# Altium schematic sheet AFE1-2.SchDoc
size A4
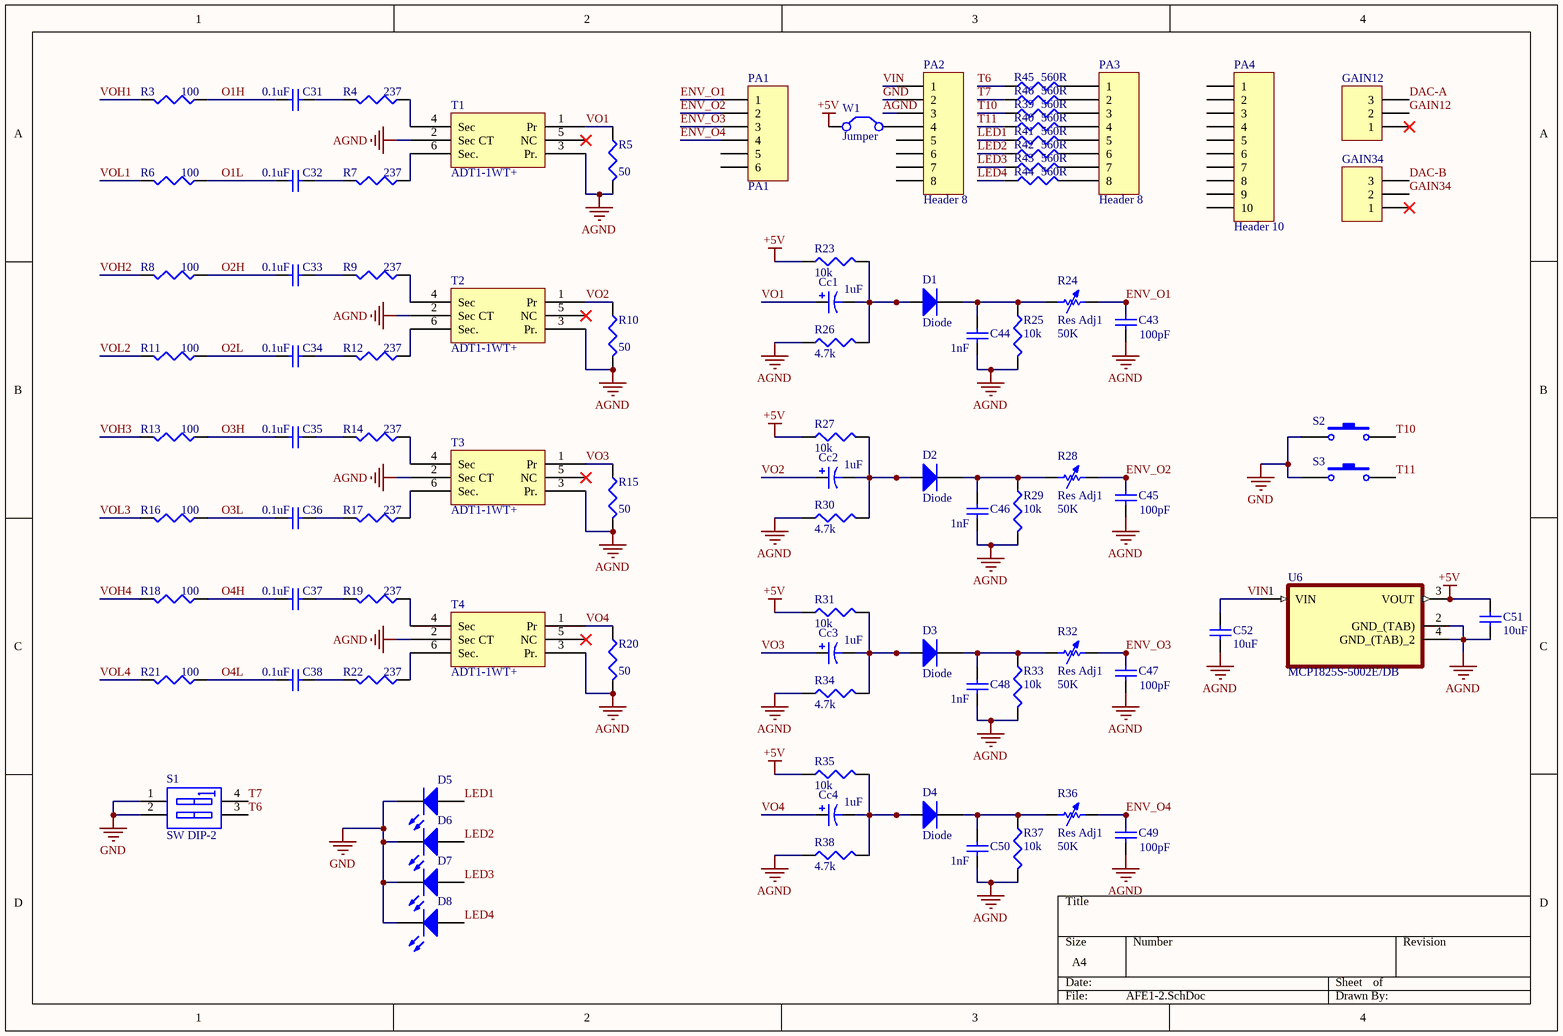
[diagram p0: AFE1-2.SchDoc]

## Parts
C31  value 0.1uF  [1608[0603]]
C32  value 0.1uF  [1608[0603]]
C33  value 0.1uF  [1608[0603]]
C34  value 0.1uF  [1608[0603]]
C35  value 0.1uF  [1608[0603]]
C36  value 0.1uF  [1608[0603]]
C37  value 0.1uF  [1608[0603]]
C38  value 0.1uF  [1608[0603]]
C43  value 100pF  [1608[0603]]
C44  value 1nF  [1608[0603]]
C45  value 100pF  [1608[0603]]
C46  value 1nF  [1608[0603]]
C47  value 100pF  [1608[0603]]
C48  value 1nF  [1608[0603]]
C49  value 100pF  [1608[0603]]
C50  value 1nF  [1608[0603]]
C51  value 10uF  [6-0805_L]
C52  value 10uF  [6-0805_L]
Cc1  value 1uF  [C0805]
Cc2  value 1uF  [C0805]
Cc3  value 1uF  [C0805]
Cc4  value 1uF  [C0805]
D1  Diode  [6-0805_L]
D2  Diode  [6-0805_L]
D3  Diode  [6-0805_L]
D4  Diode  [6-0805_L]
D5  (no value)  [6-0805_N]
D6  (no value)  [6-0805_N]
D7  (no value)  [6-0805_N]
D8  (no value)  [6-0805_N]
GAIN12  (no value)  [HDR1X3]
GAIN34  (no value)  [HDR1X3]
PA1  PA1  [HDR1X6]
PA2  Header 8  [HDR1X8]
PA3  Header 8  [HDR1X8]
PA4  Header 10  [HDR1X10]
R3  value 100  [J1-0603]
R4  value 237  [J1-0603]
R5  value 50  [J1-0603]
R6  value 100  [J1-0603]
R7  value 237  [J1-0603]
R8  value 100  [J1-0603]
R9  value 237  [J1-0603]
R10  value 50  [J1-0603]
R11  value 100  [J1-0603]
R12  value 237  [J1-0603]
R13  value 100  [J1-0603]
R14  value 237  [J1-0603]
R15  value 50  [J1-0603]
R16  value 100  [J1-0603]
R17  value 237  [J1-0603]
R18  value 100  [J1-0603]
R19  value 237  [J1-0603]
R20  value 50  [J1-0603]
R21  value 100  [J1-0603]
R22  value 237  [J1-0603]
R23  value 10k  [J1-0603]
R24  Res Adj1  value 50K  [RESC2012M]
R25  value 10k  [J1-0603]
R26  value 4.7k  [J1-0603]
R27  value 10k  [J1-0603]
R28  Res Adj1  value 50K  [RESC2012M]
R29  value 10k  [J1-0603]
R30  value 4.7k  [J1-0603]
R31  value 10k  [J1-0603]
R32  Res Adj1  value 50K  [RESC2012M]
R33  value 10k  [J1-0603]
R34  value 4.7k  [J1-0603]
R35  value 10k  [J1-0603]
R36  Res Adj1  value 50K  [RESC2012M]
R37  value 10k  [J1-0603]
R38  value 4.7k  [J1-0603]
R39  value 560R  [J1-0603]
R40  value 560R  [J1-0603]
R41  value 560R  [J1-0603]
R42  value 560R  [J1-0603]
R43  value 560R  [J1-0603]
R44  value 560R  [J1-0603]
R45  value 560R  [J1-0603]
R46  value 560R  [J1-0603]
S1  SW DIP-2  [DIP-4]
S2  (no value)  [PTS525SM08SMTR2LFS]
S3  (no value)  [PTS525SM08SMTR2LFS]
T1  ADT1-1WT+  [ADT1-1WT+]
T2  ADT1-1WT+  [ADT1-1WT+]
T3  ADT1-1WT+  [ADT1-1WT+]
T4  ADT1-1WT+  [ADT1-1WT+]
U6  MCP1825S-5002E/DB  [SOT230P700X180-4N]
W1  Jumper  [RAD-0.1]

## Nets
+5V: C51.1 R23.1 R27.1 R31.1 R35.1 U6.3(VOUT) W1.1(C1)
AGND: C43.2 C44.2 C45.2 C46.2 C47.2 C48.2 C49.2 C50.2 C51.2 C52.2 PA2.3 R5.2 R10.2 R15.2 R20.2 R25.2 R26.1 R29.2 R30.1 R33.2 R34.1 R37.2 R38.1 T1.2(Sec_CT) T1.3(Pr.) T2.2(Sec_CT) T2.3(Pr.) T3.2(Sec_CT) T3.3(Pr.) T4.2(Sec_CT) T4.3(Pr.) U6.2(GND_(TAB)) U6.4(GND_(TAB)_2)
GND: D5.2(K) D6.2(K) D7.2(K) D8.2(K) PA2.2 S1.1(A1) S1.2(A2) S2.1 S3.1
DAC-A: GAIN12.3
DAC-B: GAIN34.3
ENV_O1: C43.1 PA1.1 R24.2
ENV_O2: C45.1 PA1.2 R28.2
ENV_O3: C47.1 PA1.3 R32.2
ENV_O4: C49.1 PA1.4 R36.2
GAIN12: GAIN12.2
GAIN34: GAIN34.2
LED1: D5.1(A) R41.1
LED2: D6.1(A) R42.1
LED3: D7.1(A) R43.1
LED4: D8.1(A) R44.1
O1H: C31.1 R3.1
O1L: C32.1 R6.1
O2H: C33.1 R8.1
O2L: C34.1 R11.1
O3H: C35.1 R13.1
O3L: C36.1 R16.1
O4H: C37.1 R18.1
O4L: C38.1 R21.1
T6: R45.1 S1.3(B2)
T7: R46.1 S1.4(B1)
T10: R39.1 S2.2
T11: R40.1 S3.2
VIN: C52.1 PA2.1 U6.1(VIN)
VO1: Cc1.1 R5.1 T1.1(Pr)
VO2: Cc2.1 R10.1 T2.1(Pr)
VO3: Cc3.1 R15.1 T3.1(Pr)
VO4: Cc4.1 R20.1 T4.1(Pr)
VOH1: R3.2
VOH2: R8.2
VOH3: R13.2
VOH4: R18.2
VOL1: R6.2
VOL2: R11.2
VOL3: R16.2
VOL4: R21.2
NetC31_2: C31.2 R4.2
NetC32_2: C32.2 R7.2
NetC33_2: C33.2 R9.2
NetC34_2: C34.2 R12.2
NetC35_2: C35.2 R14.2
NetC36_2: C36.2 R17.2
NetC37_2: C37.2 R19.2
NetC38_2: C38.2 R22.2
NetC44_1: C44.1 D1.2(K) R24.1 R25.1
NetC46_1: C46.1 D2.2(K) R28.1 R29.1
NetC48_1: C48.1 D3.2(K) R32.1 R33.1
NetC50_1: C50.1 D4.2(K) R36.1 R37.1
NetCc1_2: Cc1.2 D1.1(A) R23.2 R26.2
NetCc2_2: Cc2.2 D2.1(A) R27.2 R30.2
NetCc3_2: Cc3.2 D3.1(A) R31.2 R34.2
NetCc4_2: Cc4.2 D4.1(A) R35.2 R38.2
NetPA2_4: PA2.4 W1.2(C2)
NetPA3_1: PA3.1 R45.2
NetPA3_2: PA3.2 R46.2
NetPA3_3: PA3.3 R39.2
NetPA3_4: PA3.4 R40.2
NetPA3_5: PA3.5 R41.2
NetPA3_6: PA3.6 R42.2
NetPA3_7: PA3.7 R43.2
NetPA3_8: PA3.8 R44.2
NetR4_1: R4.1 T1.4(Sec)
NetR7_1: R7.1 T1.6(Sec.)
NetR9_1: R9.1 T2.4(Sec)
NetR12_1: R12.1 T2.6(Sec.)
NetR14_1: R14.1 T3.4(Sec)
NetR17_1: R17.1 T3.6(Sec.)
NetR19_1: R19.1 T4.4(Sec)
NetR22_1: R22.1 T4.6(Sec.)

Not connected (* = marked no-connect by the designer): GAIN12 1*; GAIN34 1*; PA1 5 6; PA2 5 6 7 8; PA4 1 2 3 4 5 6 7 8 9 10; T1 5(NC)*; T2 5(NC)*; T3 5(NC)*; T4 5(NC)*

## Library data of the parts
C31-C38 C43-C52 = Cap Semi: Capacitor (Semiconductor SIM Model); Published: 8-Jun-2000; LatestRevisionDate: 29-May-2009; LatestRevisionNote: IPC-7351 Footprint Added.; PackageReference: C1206; Publisher: Altium Limited; PackageDescription: Chip Capacitor
Cc1-Cc4 = Cap Pol3: Polarized Capacitor (Surface Mount); Published: 8-Jun-2000; LatestRevisionDate: 29-May-2009; LatestRevisionNote: IPC-7351 Footprint Added.; PackageReference: C0805; Publisher: Altium Limited; PackageDescription: Chip Capacitor
D1-D4 = Diode: Default Diode; Published: 8-Jun-2000; LatestRevisionDate: 17-Jul-2002; LatestRevisionNote: Re-released for DXP Platform.; PackageVersion: Sep-1996; PackageReference: SMC; Publisher: Altium Limited; PackageDescription: DO-214-AB/SMC; 2 C-Bend Leads; Body 7.9 x 5.9 mm, inc. leads (LxW); Code_JEDEC: DO-214-AB
D5-D8 = LED3: Typical BLUE SiC LED; Published: 8-Jun-2000; LatestRevisionDate: 17-Dec-2003; LatestRevisionNote: PCB Footprint replaced.; DatasheetVersion: 16-Apr-2002; PackageVersion: 16-Apr-2002; PackageReference: 3.5X2.8X1.9; Publisher: Altium Limited; PackageDescription: SM LED; 2 C-Bend Leads; Body 3.5 x 2.8 x 1.9 mm, inc leads (LxWxH typ)
GAIN12 GAIN34 = Header 3: Header, 3-Pin; LatestRevisionDate: 17-Jul-2002; LatestRevisionNote: Re-released for DXP Platform.; Publisher: Altium Limited
PA1 = Header 6: Header, 6-Pin; LatestRevisionDate: 17-Jul-2002; LatestRevisionNote: Re-released for DXP Platform.; Publisher: Altium Limited
PA2 PA3 = Header 8: Header, 8-Pin; LatestRevisionDate: 17-Jul-2002; LatestRevisionNote: Re-released for DXP Platform.; Publisher: Altium Limited
PA4 = Header 10: Header, 10-Pin; LatestRevisionDate: 17-Jul-2002; LatestRevisionNote: Re-released for DXP Platform.; Publisher: Altium Limited
R3-R23 R25-R27 R29-R31 R33-R35 R37-R46 = Res3: Resistor; Published: 8-Jun-2000; LatestRevisionDate: 29-May-2009; LatestRevisionNote: IPC-7351 Footprint Added.; PackageReference: J1-0603; Publisher: Altium Limited; PackageDescription: Chip Resistor
R24 R28 R32 R36 = Res Adj1: Variable Resistor; Set Position: 0.5; Published: 8-Jun-2000; LatestRevisionDate: 17-Jul-2002; LatestRevisionNote: Re-released for DXP Platform.; PackageReference: AXIAL-0.7; Publisher: Altium Limited; PackageDescription: Axial Device, Thru-Hole; 2 Leads; 0.7 in Pin Spacing
S1 = SW DIP-2: DIP Switch, 2 Position, SPST; Published: 24-Mar-1999; LatestRevisionDate: 17-Jul-2002; LatestRevisionNote: Re-released for DXP Platform.; PackageReference: DIP-4; Publisher: Altium Limited
S2 S3 = SW-PB: Switch; Published: 24-Mar-1999; LatestRevisionDate: 17-Jul-2002; LatestRevisionNote: Re-released for DXP Platform.; PackageReference: SPST-2; Publisher: Altium Limited; PackageDescription: Switch; 2 Leads
U6 = MCP1825S-5002E/DB: MF: {'manufacturer': u'Microchip'}; Availability: Unavailable; Value: *; MP: MCP1825S-5002E/DB; Package: None; Price: None
W1 = Jumper: Jumper Wire; Published: 24-Mar-1999; LatestRevisionDate: 17-Jul-2002; LatestRevisionNote: Re-released for DXP Platform.; PackageReference: RAD-0.2; Publisher: Altium Limited; PackageDescription: Radial Cap, Thru-Hole; 2 Leads; 0.2 in Pin Spacing